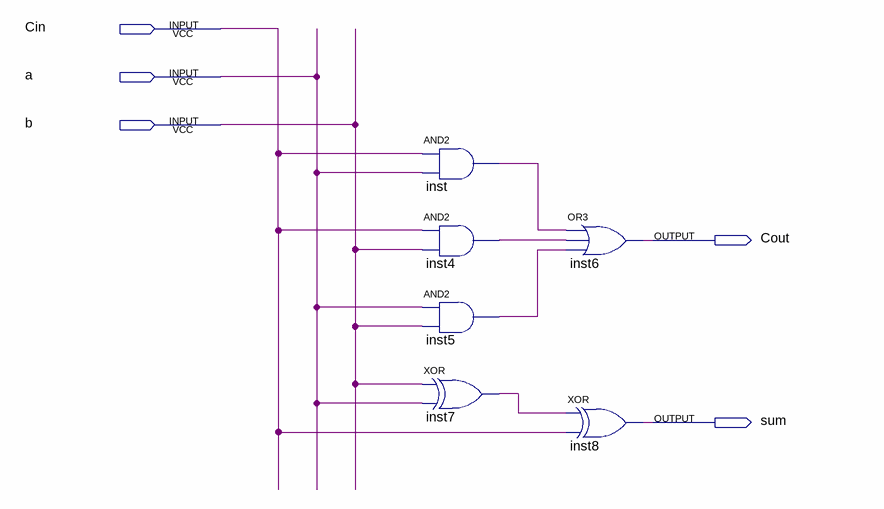
[diagram p0: schematic sheet]
// Quartus schematic FA.bdf as structural Verilog: 6 symbols, 5 pins
module FA (
  input  Cin,
  input  a,
  input  b,
  output Cout,
  output sum
);

  wire inst4_out, inst5_out, inst7_out, inst_out;

  and inst (inst_out, Cin, a);
  and inst4 (inst4_out, Cin, b);
  and inst5 (inst5_out, a, b);
  xor inst7 (inst7_out, b, a);
  or inst6 (Cout, inst_out, inst4_out, inst5_out);
  xor inst8 (sum, inst7_out, Cin);
endmodule
